# EAGLE design M214X (EAGLE 6.6.0)
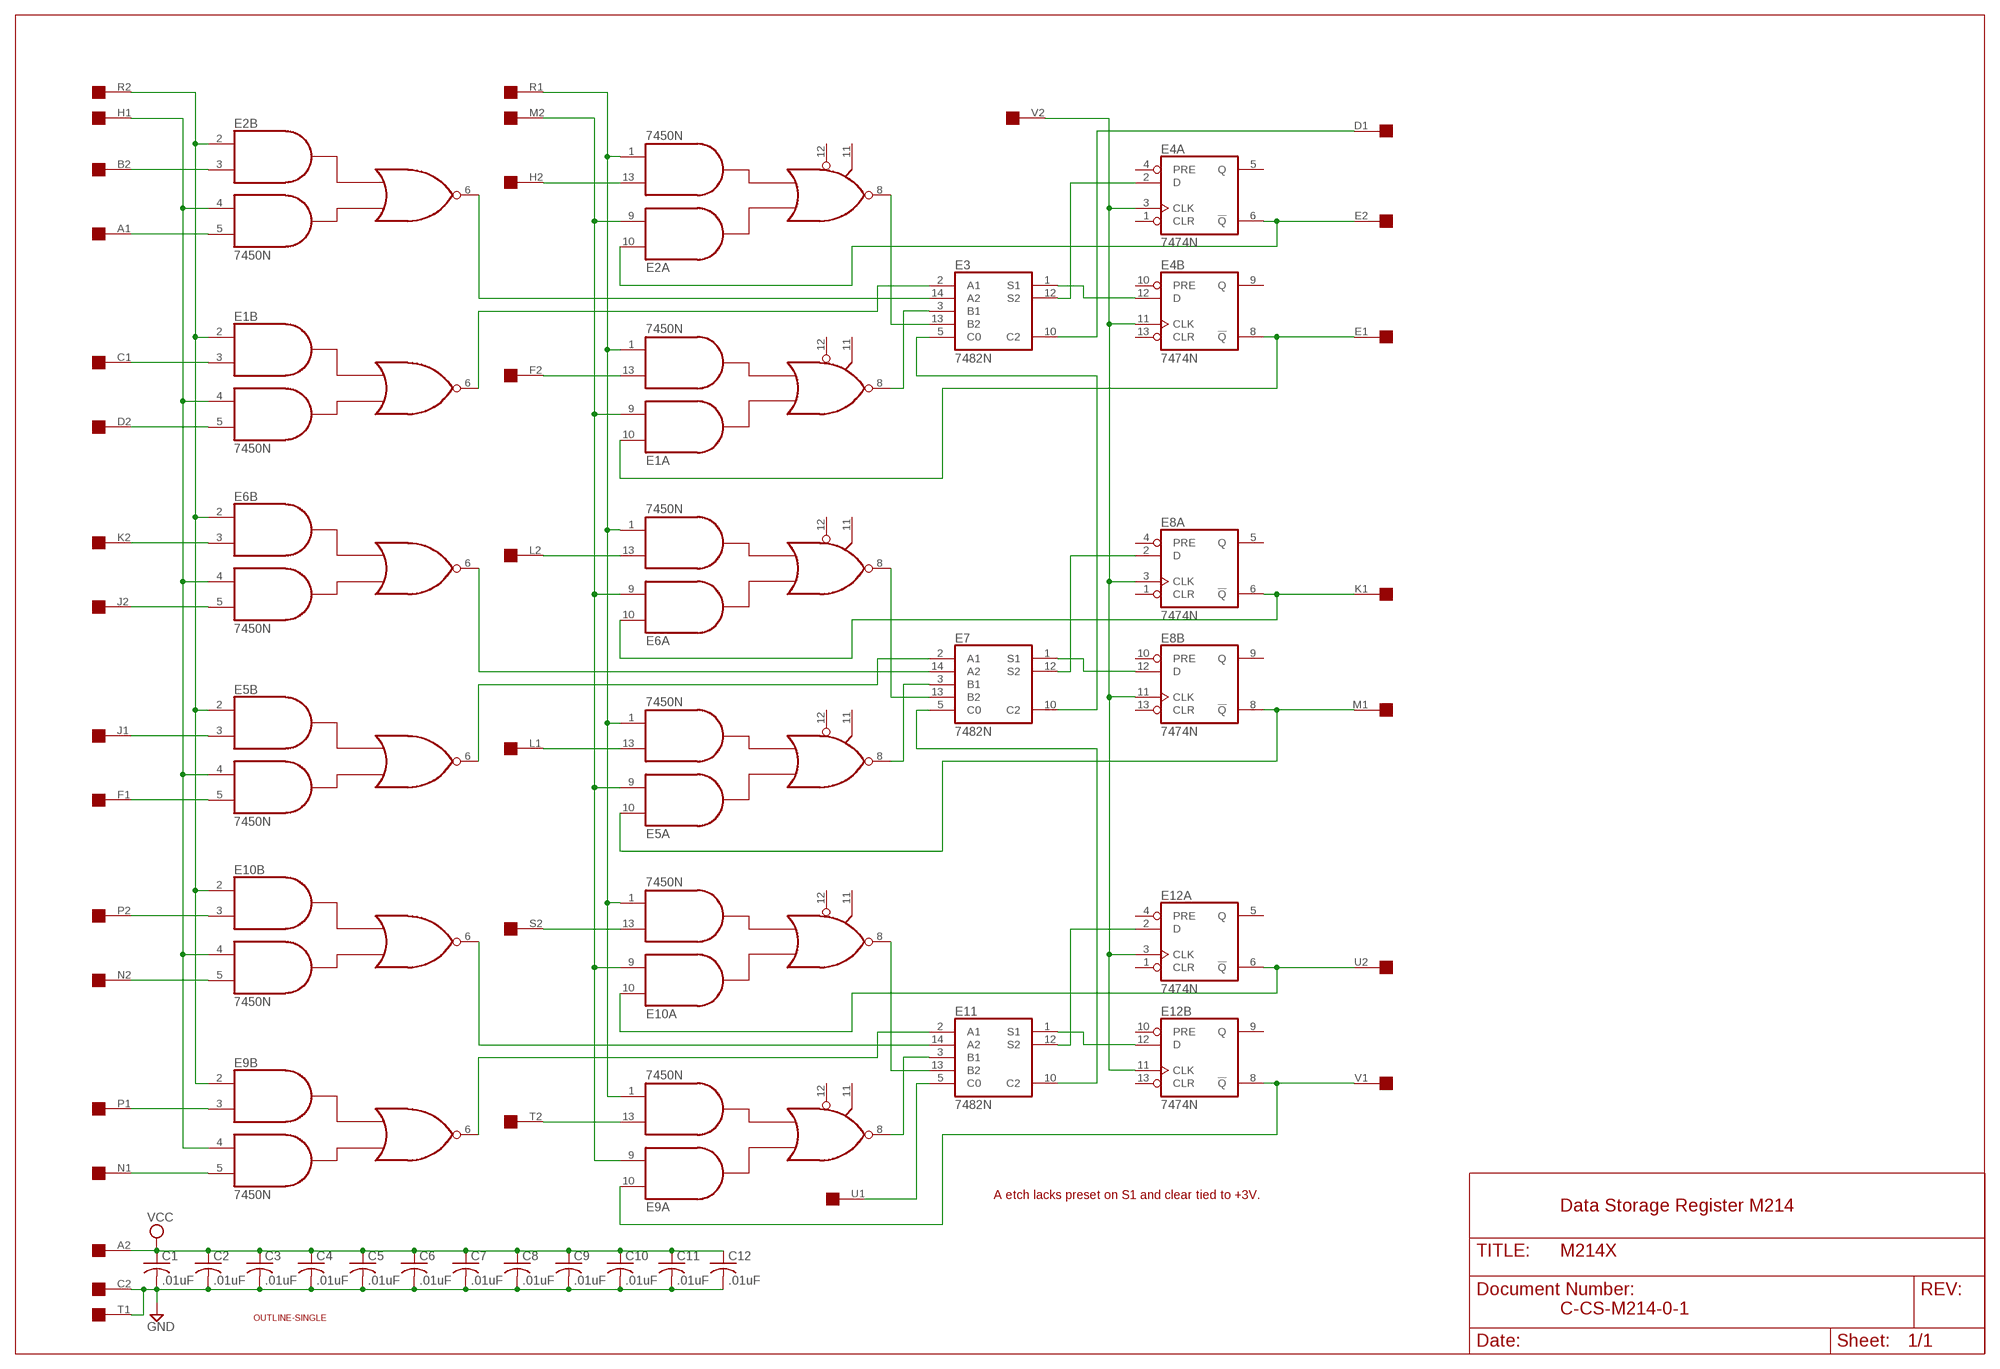
[diagram p0: schematic, sheet 1]

## Parts
C1  .01uF  C-US050-025X075  [C050-025X075]
C2  .01uF  C-US050-025X075  [C050-025X075]
C3  .01uF  C-US050-025X075  [C050-025X075]
C4  .01uF  C-US050-025X075  [C050-025X075]
C5  .01uF  C-US050-025X075  [C050-025X075]
C6  .01uF  C-US050-025X075  [C050-025X075]
C7  .01uF  C-US050-025X075  [C050-025X075]
C8  .01uF  C-US050-025X075  [C050-025X075]
C9  .01uF  C-US050-025X075  [C050-025X075]
C10  .01uF  C-US050-025X075  [C050-025X075]
C11  .01uF  C-US050-025X075  [C050-025X075]
C12  .01uF  C-US050-025X075  [C050-025X075]
E1  7450N  [DIL14]
E2  7450N  [DIL14]
E3  7482N  [DIL14]
E4  7474N  74S74N  [DIL14]
E5  7450N  [DIL14]
E6  7450N  [DIL14]
E7  7482N  [DIL14]
E8  7474N  74S74N  [DIL14]
E9  7450N  [DIL14]
E10  7450N  [DIL14]
E11  7482N  [DIL14]
E12  7474N  74S74N  [DIL14]
U$1  OUTLINE-SINGLE  [SINGLE]
U$2  SINGLE  [EDGE-CON2]

## Nets
GND [supply]: C1.2 C2.2 C3.2 C4.2 C5.2 C6.2 C7.2 C8.2 C9.2 C10.2 C11.2 C12.2 U$2.C2 U$2.T1
N$1: E1.1(A:I4) E2.1(A:I4) E5.1(A:I4) E6.1(A:I4) E9.1(A:I4) E10.1(A:I4) U$2.R1
N$2: E1.9(A:I2) E2.9(A:I2) E5.9(A:I2) E6.9(A:I2) E9.9(A:I2) E10.9(A:I2) U$2.M2
N$3: E2.13(A:I3) U$2.H2
N$4: E1.13(A:I3) U$2.F2
N$5: E1.2(B:I1) E2.2(B:I1) E5.2(B:I1) E6.2(B:I1) E9.2(B:I1) E10.2(B:I1) U$2.R2
N$6: E1.4(B:I3) E2.4(B:I3) E5.4(B:I3) E6.4(B:I3) E9.4(B:I3) E10.4(B:I3) U$2.H1
N$7: E2.6(B:O) E3.14(A2)
N$8: E2.8(A:O) E3.13(B2)
N$9: E1.8(A:O) E3.3(B1)
N$10: E1.6(B:O) E3.2(A1)
N$11: E3.5(C0) E7.10(C2)
N$12: E3.12(S2) E4.2(A:D)
N$13: E3.1(S1) E4.12(B:D)
N$15: E4.3(A:CLK) E4.11(B:CLK) E8.3(A:CLK) E8.11(B:CLK) E12.3(A:CLK) E12.11(B:CLK) U$2.V2
N$16: E1.10(A:I1) E4.8(B:!Q) U$2.E1
N$17: E2.10(A:I1) E4.6(A:!Q) U$2.E2
N$18: E2.3(B:I2) U$2.B2
N$19: E2.5(B:I4) U$2.A1
N$20: E1.3(B:I2) U$2.C1
N$21: E1.5(B:I4) U$2.D2
N$22: E3.10(C2) U$2.D1
N$25: E6.13(A:I3) U$2.L2
N$26: E5.13(A:I3) U$2.L1
N$29: E6.6(B:O) E7.14(A2)
N$30: E6.8(A:O) E7.13(B2)
N$31: E5.8(A:O) E7.3(B1)
N$32: E5.6(B:O) E7.2(A1)
N$33: E7.5(C0) E11.10(C2)
N$34: E7.12(S2) E8.2(A:D)
N$35: E7.1(S1) E8.12(B:D)
N$38: E5.10(A:I1) E8.8(B:!Q) U$2.M1
N$39: E6.10(A:I1) E8.6(A:!Q) U$2.K1
N$40: E6.3(B:I2) U$2.K2
N$41: E6.5(B:I4) U$2.J2
N$42: E5.3(B:I2) U$2.J1
N$43: E5.5(B:I4) U$2.F1
N$47: E10.13(A:I3) U$2.S2
N$48: E9.13(A:I3) U$2.T2
N$51: E10.6(B:O) E11.14(A2)
N$52: E10.8(A:O) E11.13(B2)
N$53: E9.8(A:O) E11.3(B1)
N$54: E9.6(B:O) E11.2(A1)
N$55: E11.5(C0) U$2.U1
N$56: E11.12(S2) E12.2(A:D)
N$57: E11.1(S1) E12.12(B:D)
N$60: E9.10(A:I1) E12.8(B:!Q) U$2.V1
N$61: E10.10(A:I1) E12.6(A:!Q) U$2.U2
N$62: E10.3(B:I2) U$2.P2
N$63: E10.5(B:I4) U$2.N2
N$64: E9.3(B:I2) U$2.P1
N$65: E9.5(B:I4) U$2.N1
VCC [supply]: C1.1 C2.1 C3.1 C4.1 C5.1 C6.1 C7.1 C8.1 C9.1 C10.1 C11.1 C12.1 U$2.A2
Unconnected: E1.11(A:I6) E1.12(A:I5) E2.11(A:I6) E2.12(A:I5) E3.6 E3.7 E3.8 E3.9 E4.1(A:CLR) E4.4(A:PRE) E4.5(A:Q) E4.9(B:Q) E4.10(B:PRE) E4.13(B:CLR) E5.11(A:I6) E5.12(A:I5) E6.11(A:I6) E6.12(A:I5) E7.6 E7.7 E7.8 E7.9 E8.1(A:CLR) E8.4(A:PRE) E8.5(A:Q) E8.9(B:Q) E8.10(B:PRE) E8.13(B:CLR) E9.11(A:I6) E9.12(A:I5) E10.11(A:I6) E10.12(A:I5) E11.6 E11.7 E11.8 E11.9 E12.1(A:CLR) E12.4(A:PRE) E12.5(A:Q) E12.9(B:Q) E12.10(B:PRE) E12.13(B:CLR) U$2.B1 U$2.S1

## Notes on the sheet
- A etch lacks preset on S1 and clear tied to +3V.
- Data Storage Register M214
- C-CS-M214-0-1

## Power pins joined to a net without a drawn wire
GND: E1.7(P:GND) E2.7(P:GND) E3.11(GND) E4.7(P:GND) E5.7(P:GND) E6.7(P:GND) E7.11(GND) E8.7(P:GND) E9.7(P:GND) E10.7(P:GND) E11.11(GND) E12.7(P:GND)
VCC: E1.14(P:VCC) E2.14(P:VCC) E3.4(VCC) E4.14(P:VCC) E5.14(P:VCC) E6.14(P:VCC) E7.4(VCC) E8.14(P:VCC) E9.14(P:VCC) E10.14(P:VCC) E11.4(VCC) E12.14(P:VCC)

## Library data of the parts
C1-C12 = rcl:C-US: CAPACITOR, American symbol
E1 E2 E5 E6 E9 E10 = dec-con:74*50: 4-2-3-2 input AND OR INVERTER gates
E3 E7 E11 = dec-con:74*82: 2-bit binary full ADDER Has the wrong GND pin in other libraries.
E4 E8 E12 = 74xx-us:74*74: Dual D type positive edge triggered FLIP FLOP, preset and clear
U$1 = dec-con:OUTLINE-*: Board outlines for DEC boards.
U$2 = dec-con:SINGLE: Single-Height DEC board

## Net classes
1 supply: width 0.813 mm

## Board
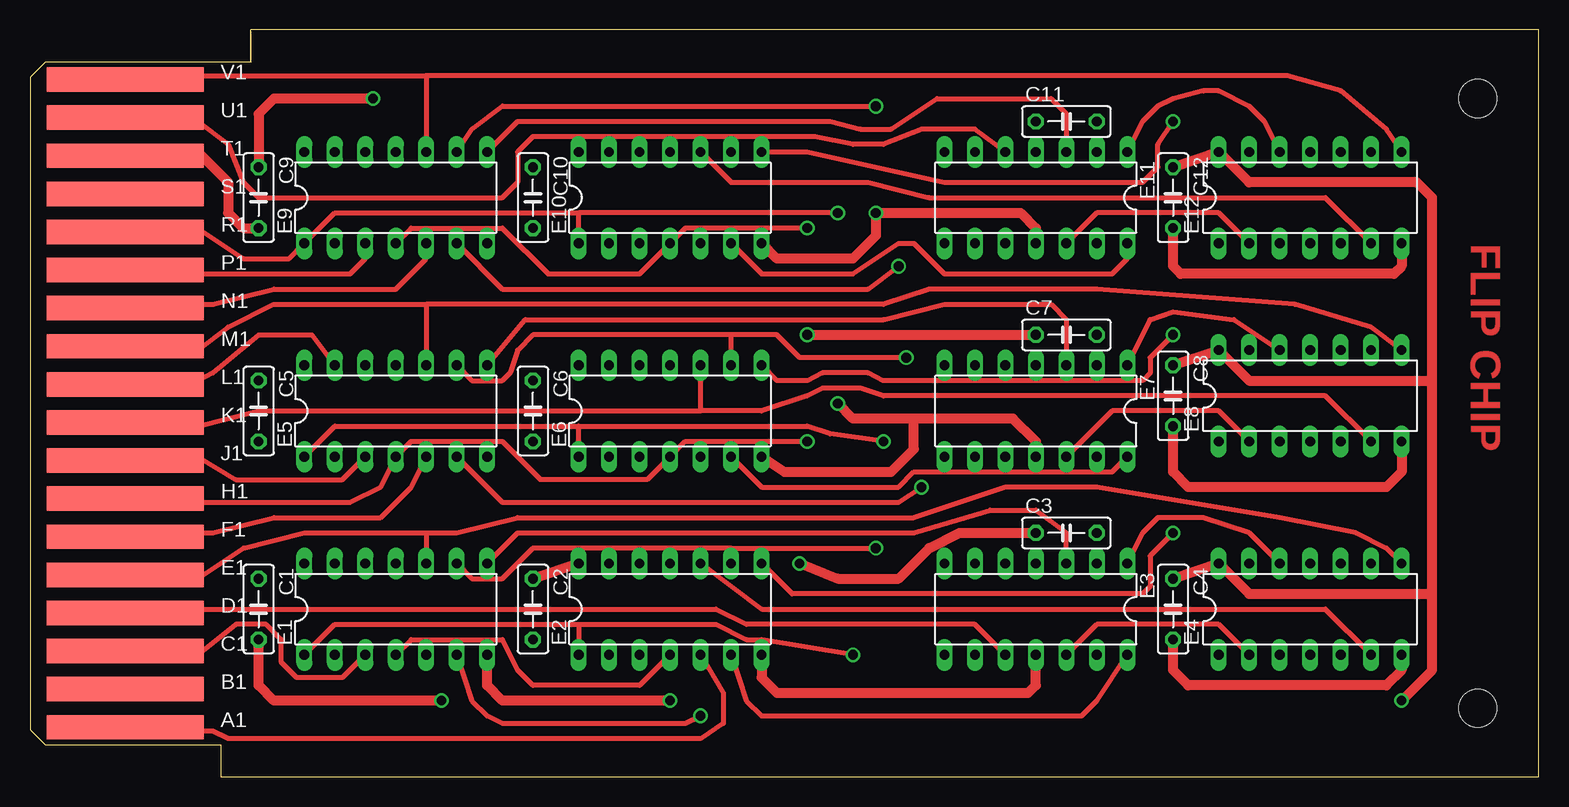
[diagram p1: board, top side]
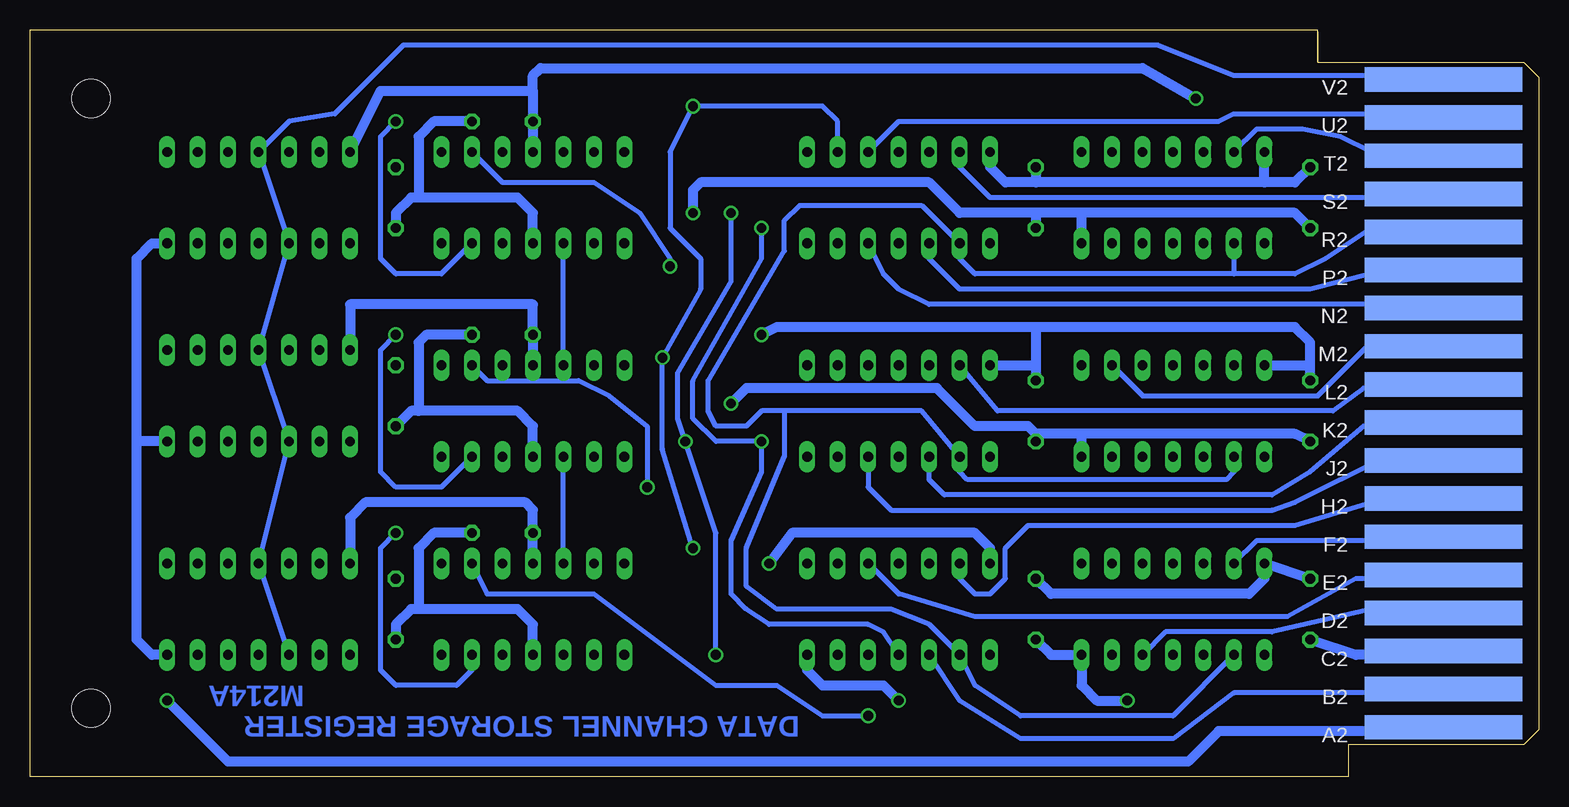
[diagram p2: board, bottom side, seen from below]

Size 125.73 x 62.23 mm. Coordinates in mm from the lower left corner, seen from the top.
Copper layers (1+16): Top 0.035mm / dielectric 1.5mm / Bottom 0.035mm
Design rules "16mils": minimum track width 16mil, minimum drill 32mil, track to track 15mil, track to pad 10mil, pad to pad 10mil, via to via 10mil, smd to smd 10mil, copper to edge 13mil, drill to drill 10mil, minimum pad ring 10mil, minimum via ring 8mil, stop-mask expansion 0mil, vias tented up to drill 0mil, thermal gap 10mil

### Footprints (pad centres in the part's own frame; a part is rotated, then mirrored left to right if it is on the bottom)
C050-025X075 = drill 0.813 octagon: 1 -2.54,0; 2 2.54,0
DIL14 = drill 0.813 long: 1 -7.62,-3.81; 2 -5.08,-3.81; 3 -2.54,-3.81; 4 0,-3.81; 5 2.54,-3.81; 6 5.08,-3.81; 7 7.62,-3.81; 8 7.62,3.81; 9 5.08,3.81; 10 2.54,3.81; 11 0,3.81; 12 -2.54,3.81; 13 -5.08,3.81; 14 -7.62,3.81
SINGLE = hole 3.175: 120.65,56.515; 120.65,5.715
EDGE-CON2 = smd 13.106 x 2.032: A1 7.938,4.128; B1 7.938,7.303; C1 7.938,10.477; D1 7.938,13.652; E1 7.938,16.828; F1 7.938,20.003; H1 7.938,23.177; J1 7.938,26.352; K1 7.938,29.527; L1 7.938,32.703; M1 7.938,35.877; N1 7.938,39.053; P1 7.938,42.227; R1 7.938,45.403; S1 7.938,48.578; T1 7.938,51.752; U1 7.938,54.928; V1 7.938,58.102 | smd 13.106 x 2.032 bottom: A2 7.938,4.128; B2 7.938,7.303; C2 7.938,10.477; D2 7.938,13.652; E2 7.938,16.828; F2 7.938,20.003; H2 7.938,23.177; J2 7.938,26.352; K2 7.938,29.527; L2 7.938,32.703; M2 7.938,35.877; N2 7.938,39.053; P2 7.938,42.227; R2 7.938,45.403; S2 7.938,48.578; T2 7.938,51.752; U2 7.938,54.928; V2 7.938,58.102

### Placement (x,y rotation side)
C1  19.05,13.97 270 top
C2  41.91,13.97 270 top
C3  86.36,20.32 0 top
C4  95.25,13.97 270 top
C5  19.05,30.48 270 top
C6  41.91,30.48 270 top
C7  86.36,36.83 0 top
C8  95.25,31.75 270 top
C9  19.05,48.26 270 top
C10  41.91,48.26 270 top
C11  86.36,54.61 0 top
C12  95.25,48.26 270 top
E1  30.48,13.97 0 top
E2  53.34,13.97 0 top
E3  83.82,13.97 180 top
E4  106.68,13.97 0 top
E5  30.48,30.48 0 top
E6  53.34,30.48 0 top
E7  83.82,30.48 180 top
E8  106.68,31.75 0 top
E9  30.48,48.26 0 top
E10  53.34,48.26 0 top
E11  83.82,48.26 180 top
E12  106.68,48.26 0 top
U$1  0,0 0 top
U$2  0,0 0 top

### Tracks (layer width: path | path; a pad name or v marks a point on that pad's centre or on a via)
GND  (via drill 0.81)
  Top 0.813: v53.34,6.35 39.37,6.35 38.1,7.62 E1.7 | v34.29,6.35 20.32,6.35 19.05,7.62 C1.2 | E8.7 114.3,25.4 113.03,24.13 96.52,24.13 95.25,25.4 C8.2 | E4.7 114.3,8.89 113.03,7.62 96.52,7.62 95.25,8.89 C4.2 | U$2.T1 8.89,52.07 13.97,52.07 16.51,49.53 16.51,46.99 17.78,45.72 C9.2 | E10.7 62.23,43.18 68.58,43.18 70.49,45.09 v70.49,46.99 82.55,46.99 83.82,45.72 E11.11 | E6.7 62.87,25.4 71.76,25.4 73.66,27.3 73.66,29.84 | 73.66,29.84 68.58,29.84 v67.31,31.11 | E7.11 83.82,27.94 81.92,29.84 73.66,29.84 | E2.7 60.96,8.26 62.23,6.99 83.19,6.99 83.82,7.62 E3.11 | E12.7 114.3,42.55 113.67,41.91 95.89,41.91 95.25,42.55 C12.2
  Bottom 0.813: v34.29,6.35 36.83,6.35 38.1,7.62 E1.7 40.64,10.16 C2.2 | U$2.C2 12.7,10.16 15.24,10.16 C1.2 | E2.7 60.96,8.89 59.69,7.62 54.61,7.62 v53.34,6.35 | E3.11 83.82,12.7 85.09,13.97 93.35,13.97 | 93.35,13.97 93.98,13.97 95.25,12.7 C4.2 | C3.2 92.08,20.32 93.35,19.05 93.35,13.97 | C5.2 20.32,28.57 38.1,28.57 | 38.1,28.57 41.91,28.57 | 41.91,28.57 C6.2 | E5.7 38.1,28.57 | 41.91,28.57 42.55,29.21 46.99,29.21 50.17,32.38 66.04,32.38 v67.31,31.11 | C9.2 20.32,46.99 38.1,46.99 | 38.1,46.99 41.91,46.99 | 41.91,46.99 C10.2 | E9.7 38.1,46.99 | 41.91,46.99 48.26,46.99 50.8,49.53 69.85,49.53 70.49,48.9 v70.49,46.99 | C7.2 92.71,36.83 93.35,36.2 93.35,30.48 | 93.35,30.48 93.98,30.48 C8.2 | E7.11 83.82,29.21 85.09,30.48 93.35,30.48 | E11.11 83.82,46.99 85.09,48.26 93.35,48.26 | 93.35,48.26 93.98,48.26 95.25,46.99 C12.2 | C11.2 92.08,54.61 93.35,53.34 93.35,48.26 | E4.7 115.57,10.16 116.84,11.43 116.84,27.94 | 116.84,27.94 116.84,43.18 115.57,44.45 E12.7 | E8.7 116.84,27.94
N$1  (via drill 0.81)
  Top 0.406: U$2.R1 8.89,45.72 13.97,45.72 17.78,43.18 21.59,43.18 E9.1 25.4,46.99 45.72,46.99 | v67.31,46.99 45.72,46.99 | v68.58,10.16 60.96,11.43 59.69,11.43 57.15,12.7 45.72,12.7 | v71.12,27.94 66.68,28.57 64.77,29.21 45.72,29.21 | E10.1 45.72,46.99 | E6.1 45.72,29.21 | E5.1 25.4,29.21 45.72,29.21 | E1.1 25.4,12.7 45.72,12.7 | 45.72,12.7 E2.1
  Bottom 0.406: v68.58,10.16 68.58,20.32 v71.12,27.94 71.76,29.84 71.76,33.66 67.31,41.27 v67.31,46.99
N$2  (via drill 0.81)
  Top 0.406: E9.9 36.83,53.98 39.37,55.88 v70.49,55.88 | v73.03,34.92 64.14,34.92 62.23,36.83 58.42,36.83 | 58.42,36.83 41.91,36.83 40.64,35.56 40.01,33.66 39.37,33.02 36.83,33.02 E5.9 | E6.9 58.42,36.83 | E2.9 58.42,19.05 | 58.42,19.05 41.91,19.05 39.37,16.51 36.83,16.51 E1.9 | 58.42,19.05 v70.49,19.05
  Bottom 0.406: E10.9 58.42,54.61 59.69,55.88 v70.49,55.88 72.39,52.07 72.39,45.72 69.85,43.18 69.85,40.64 v73.03,34.92 73.03,27.3 v70.49,19.05 | E5.9 33.02,31.75 18.42,31.75 13.97,36.2 8.26,36.2 U$2.M2
N$3
  Bottom 0.406: E2.13 48.26,16.51 46.99,15.24 45.72,15.24 44.45,16.51 44.45,19.05 42.55,20.95 20.32,20.95 13.97,22.86 8.89,22.86 U$2.H2
N$4
  Bottom 0.406: U$2.F2 10.16,20.32 10.8,20.32 11.43,19.68 22.86,19.68 23.5,19.68 E1.13
N$5
  Bottom 0.406: E1.2 30.48,5.08 43.18,5.08 46.99,7.62 E2.2 50.8,12.7 53.98,13.97 63.5,13.97 66.04,15.88 66.04,19.05 62.87,26.67 62.87,30.48 | E5.2 25.4,25.4 26.04,24.77 47.63,24.77 48.26,25.4 E6.2 51.44,30.48 62.87,30.48 | 62.87,30.48 64.77,30.48 66.04,29.21 68.58,29.21 69.22,30.48 69.22,33.02 62.87,43.81 62.87,46.35 61.6,47.62 51.44,47.62 E10.2 48.26,43.18 46.99,41.91 25.4,41.91 | U$2.R2 10.16,45.72 13.97,45.72 17.78,43.18 20.32,41.91 25.4,41.91 | E9.2 25.4,41.91
N$6  (via drill 0.81)
  Top 0.406: U$2.H1 8.89,22.86 26.67,22.86 29.21,24.13 E5.4 31.75,27.94 39.37,27.94 42.55,24.77 51.44,24.77 E6.4 54.61,27.94 v64.77,27.94 | v64.77,45.72 54.61,45.72 E10.4 50.8,41.91 43.18,41.91 39.37,45.72 31.75,45.72 E9.4 | E2.4 50.8,7.62 41.91,7.62 40.64,8.89 39.37,11.43 31.75,11.43 E1.4
  Bottom 0.406: E2.4 54.61,12.06 55.88,12.7 64.14,12.7 66.04,13.97 67.31,15.24 67.31,19.68 64.77,25.4 v64.77,27.94 68.58,27.94 70.49,29.84 70.49,33.02 64.77,43.18 v64.77,45.72
N$7
  Top 0.406: E2.6 59.69,6.35 60.96,5.08 87.63,5.08 88.9,6.35 E3.14
N$8  (via drill 0.81)
  Top 0.406: v95.25,20.32 93.35,18.41 93.35,15.88 92.71,15.24 63.5,15.24 E2.8
  Bottom 0.406: E3.13 88.9,8.89 90.17,7.62 95.25,7.62 96.52,8.89 96.52,19.05 v95.25,20.32
N$9
  Top 0.406: E1.8 40.64,20.32 73.66,20.32 80.01,22.23 83.82,22.23 86.36,20.32 E3.3
N$10  (via drill 0.81)
  Top 0.406: E1.6 36.83,6.35 38.1,5.08 39.37,4.45 54.61,4.45 v55.88,5.08
  Bottom 0.406: E3.2 87.63,15.24 78.74,15.24 68.58,7.62 63.5,7.62 59.69,5.08 v55.88,5.08
N$11
  Bottom 0.406: E3.5 E7.10
N$12
  Top 0.406: E4.2 99.06,12.7 88.9,12.7 E3.12
N$13
  Top 0.406: E4.12 101.6,20.32 97.79,21.59 93.98,21.59 92.71,20.32 E3.1
N$15
  Bottom 0.406: E4.3 E4.11 E8.3 E8.11 E12.3 E12.11 104.14,54.61 100.33,55.24 94.62,60.96 31.75,60.96 25.4,58.42 10.16,58.42 U$2.V2
N$16
  Top 0.406: U$2.E1 9.53,16.51 13.97,16.51 17.78,19.05 22.86,20.32 33.02,20.32 | 33.02,20.32 E1.10 | 33.02,20.32 35.56,20.32 40.64,21.59 73.66,21.59 81.28,24.13 88.9,24.13 104.14,21.59 110.49,20.32 113.03,19.05 E4.8
N$17
  Top 0.406: E4.6 107.95,13.97 60.96,13.97 E2.10
  Bottom 0.406: U$2.E2 8.89,16.51 15.24,16.51 20.96,13.34 46.99,13.34 53.34,15.24 E2.10
N$18
  Bottom 0.406: U$2.B2 10.16,6.99 25.4,6.99 30.48,3.17 43.18,3.17 48.26,6.35 E2.3
N$19
  Top 0.406: E2.5 57.79,6.99 57.79,4.45 55.88,3.17 16.51,3.17 15.24,3.81 8.89,3.81 U$2.A1
N$20
  Top 0.406: U$2.C1 8.89,10.16 13.97,10.16 17.15,12.7 19.69,12.7 20.96,11.43 20.96,9.53 22.23,8.26 26.04,8.26 E1.3
N$21
  Bottom 0.406: U$2.D2 10.16,13.97 13.97,13.97 22.23,12.06 31.12,12.06 E1.5
N$22
  Top 0.406: U$2.D1 8.89,13.97 57.15,13.97 59.69,12.7 78.74,12.7 E3.10
N$25
  Bottom 0.406: U$2.L2 12.07,32.38 14.61,32.38 17.15,30.48 45.09,30.48 E6.13
N$26
  Top 0.406: U$2.L1 8.89,33.02 13.97,33.02 15.24,33.66 19.05,36.83 23.5,36.83 E5.13
N$29
  Top 0.406: E6.6 60.96,24.13 72.39,24.13 73.66,25.4 90.17,25.4 E7.14
N$30  (via drill 0.81)
  Top 0.406: v95.25,36.83 93.35,34.92 93.35,33.66 92.71,33.02 71.12,33.02 69.85,33.66 66.04,33.66 64.77,33.02 62.23,33.02 E6.8
  Bottom 0.406: E7.13 91.44,24.13 95.25,24.13 96.52,25.4 96.52,35.56 v95.25,36.83
N$31
  Top 0.406: E5.8 41.28,38.1 71.12,38.1 76.2,39.37 85.09,39.37 86.36,38.1 E7.3
N$32  (via drill 0.81)
  Top 0.406: E5.6 39.37,22.86 72.39,22.86 v74.3,24.13
  Bottom 0.406: E7.2 87.63,33.02 80.01,33.02 77.47,31.75 74.3,29.21 v74.3,24.13
N$33
  Bottom 0.406: E7.5 E11.10
N$34
  Top 0.406: E8.2 99.06,30.48 90.17,30.48 E7.12
N$35
  Top 0.406: E7.1 93.35,38.1 95.25,38.73 100.33,38.1 E8.12
N$38
  Top 0.406: E8.8 111.76,37.47 105.41,39.37 88.9,40.64 74.93,40.64 71.12,39.37 33.02,39.37 | 33.02,39.37 E5.10 | U$2.M1 8.89,35.56 13.97,35.56 16.51,37.47 20.32,39.37 33.02,39.37
N$39
  Top 0.406: U$2.K1 8.89,29.21 13.97,29.21 19.05,30.48 55.88,30.48 | E8.6 107.95,31.75 71.12,31.75 69.22,32.38 66.04,32.38 64.77,31.75 60.96,30.48 55.88,30.48 | 55.88,30.48 E6.10
N$40
  Bottom 0.406: U$2.K2 11.43,29.21 14.61,29.21 19.05,25.4 22.23,23.5 49.53,23.5 50.8,24.77 E6.3
N$41
  Bottom 0.406: E6.5 55.88,24.13 53.98,22.23 22.23,22.23 20.32,22.86 12.7,26.67 8.89,26.67 U$2.J2
N$42
  Top 0.406: U$2.J1 8.89,26.67 13.97,26.67 17.15,24.77 26.04,24.77 E5.3
N$43
  Top 0.406: U$2.F1 8.89,20.32 15.24,20.32 20.32,21.59 29.21,21.59 31.75,24.13 E5.5
N$47
  Bottom 0.406: U$2.S2 11.43,48.26 45.72,48.26 48.26,50.8 E10.13
N$48
  Bottom 0.406: U$2.T2 8.89,52.07 13.97,52.07 16.51,53.34 19.69,53.98 23.5,53.98 E9.13
N$51
  Top 0.406: E10.6 60.96,41.91 68.58,41.91 72.39,44.45 73.66,44.45 76.2,41.91 90.17,41.91 91.44,43.18 E11.14
N$52  (via drill 0.81)
  Top 0.406: E10.8 64.77,52.07 76.2,49.53 92.71,49.53 93.98,50.8 93.98,52.7 v95.25,54.61
  Bottom 0.406: E11.13 91.44,41.91 95.25,41.91 96.52,43.18 96.52,53.34 v95.25,54.61
N$53
  Top 0.406: E9.8 40.64,54.61 66.68,54.61 69.22,53.98 71.76,53.98 75.57,56.52 85.09,56.52 86.36,55.24 E11.3
N$54  (via drill 0.81)
  Top 0.406: E9.6 39.37,40.64 69.85,40.64 v72.39,42.55
  Bottom 0.406: E11.2 86.36,49.53 78.74,49.53 74.93,46.99 72.39,43.18 v72.39,42.55
N$55
  Top 0.406: U$2.U1 8.89,54.61 13.97,54.61 16.51,52.7 17.78,49.53 19.05,48.26 39.37,48.26 40.64,49.53 40.64,52.07 41.91,53.34 65.41,53.34 68.58,52.7 71.12,52.7 74.3,53.98 78.74,53.98 E11.5
N$56
  Top 0.406: E12.2 99.06,46.99 88.9,46.99 E11.12
N$57
  Top 0.406: E12.12 102.87,54.61 101.6,55.88 99.06,57.15 97.79,57.15 95.25,56.52 93.98,55.88 92.71,54.61 E11.1
N$60
  Top 0.406: E12.8 113.03,53.98 109.22,57.15 104.78,58.42 33.02,58.42 | 33.02,58.42 E9.10 | U$2.V1 10.16,58.42 33.02,58.42
N$61
  Top 0.406: E10.10 58.42,49.53 69.85,49.53 74.93,48.26 107.95,48.26 E12.6
  Bottom 0.406: E10.10 53.34,54.61 26.67,54.61 25.4,55.24 8.89,55.24 U$2.U2
N$62
  Bottom 0.406: U$2.P2 10.16,41.91 13.97,41.91 19.05,40.64 48.26,40.64 50.8,43.18 E10.3
N$63
  Bottom 0.406: U$2.N2 10.16,39.37 50.8,39.37 53.34,40.64 54.61,41.91 E10.5
N$64
  Top 0.406: U$2.P1 8.89,41.91 26.67,41.91 27.94,43.18 E9.3
N$65
  Top 0.406: U$2.N1 10.16,39.37 15.24,39.37 20.32,40.64 30.48,40.64 33.02,43.18 E9.5
VCC  (via drill 0.81)
  Top 0.813: v114.3,6.35 116.84,8.89 116.84,15.24 | 116.84,15.24 116.84,33.02 | 116.84,33.02 116.84,48.26 115.57,49.53 101.6,49.53 E12.14 C12.1 | C2.1 E2.14 | v28.58,56.52 20.32,56.52 19.05,55.24 C9.1 | C8.1 E8.14 101.6,33.02 116.84,33.02 | C4.1 E4.14 101.6,15.24 116.84,15.24 | v64.77,36.83 C7.1 | v64.14,17.78 67.31,16.51 72.39,16.51 74.93,19.05 77.47,20.32 C3.1
  Bottom 0.813: U$2.A2 10.16,4.13 10.16,3.81 26.67,3.81 29.21,1.27 109.22,1.27 v114.3,6.35 | C1.1 E1.14 22.86,16.51 24.13,15.24 40.64,15.24 C2.1 | E2.14 45.72,19.05 46.99,20.32 62.23,20.32 v64.14,17.78 | E11.4 C11.1 83.82,57.15 | E7.4 C7.1 83.82,39.37 99.06,39.37 E8.14 | E12.14 96.52,57.15 83.82,57.15 | 83.82,57.15 83.82,58.42 83.19,59.05 33.02,59.05 v28.58,56.52 | C5.1 19.05,34.29 | 19.05,34.29 19.05,36.2 20.32,37.47 41.91,37.47 | 41.91,37.47 41.91,34.29 | 41.91,34.29 C6.1 | 41.91,37.47 63.5,37.47 v64.77,36.83 | E6.14 41.91,34.29 | C9.1 20.32,49.53 22.86,49.53 | 22.86,49.53 E9.14 | 22.86,49.53 41.91,49.53 | 41.91,49.53 44.45,49.53 45.72,50.8 E10.14 | C10.1 41.91,49.53 | E3.4 C3.1 83.82,22.23 84.46,22.86 97.79,22.86 99.06,21.59 E4.14 | E5.14 19.05,34.29

### Text on the board
Top: FLIP CHIP
Bottom: M214A | DATA CHANNEL STORAGE REGISTER